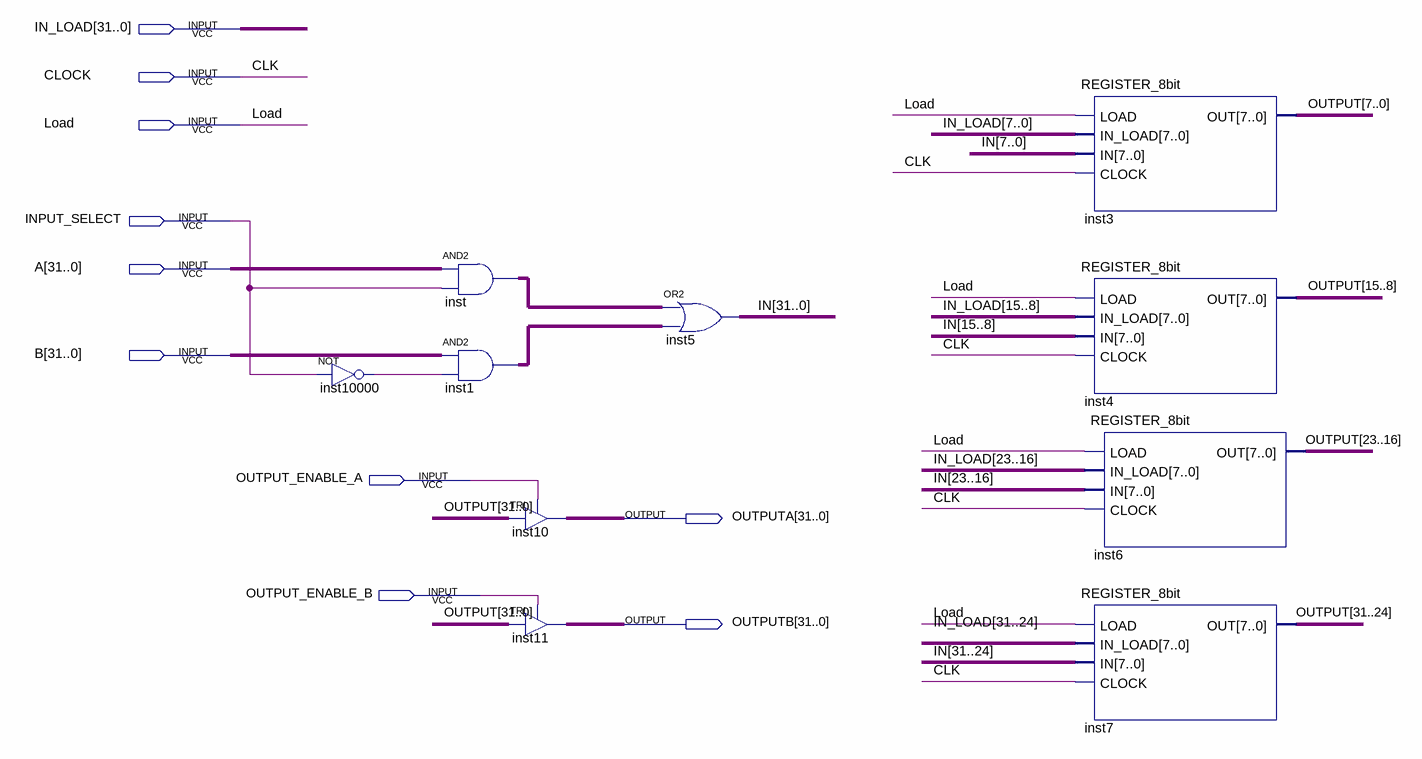
[diagram p0: schematic sheet]
// Quartus schematic REGISTER_32bits.bdf as structural Verilog: 10 symbols, 10 pins
module REGISTER_32bits (
  input  [31:0] IN_LOAD,
  input  CLOCK,
  input  Load,
  input  INPUT_SELECT,
  input  [31:0] A,
  input  [31:0] B,
  input  OUTPUT_ENABLE_A,
  input  OUTPUT_ENABLE_B,
  output [31:0] OUTPUTA,
  output [31:0] OUTPUTB
);

  wire inst10000_out;
  wire [31:0] IN, inst1_out, inst_out, OUTPUT;

  not inst10000 (inst10000_out, INPUT_SELECT);
  assign inst_out = A & {32{INPUT_SELECT}};  // AND2 inst, 32 bits wide
  assign inst1_out = B & {32{inst10000_out}};  // AND2 inst1, 32 bits wide
  TRI inst10[31:0] (.IN(OUTPUT), .OE(OUTPUT_ENABLE_A), .OUT(OUTPUTA));
  TRI inst11[31:0] (.IN(OUTPUT), .OE(OUTPUT_ENABLE_B), .OUT(OUTPUTB));
  assign IN = inst_out | inst1_out;  // OR2 inst5, 32 bits wide
  REGISTER_8bit inst3 (.LOAD(Load), .IN_LOAD(IN_LOAD[7:0]), .IN(IN[7:0]), .CLOCK(CLOCK), .OUT(OUTPUT[7:0]));
  REGISTER_8bit inst4 (.LOAD(Load), .IN_LOAD(IN_LOAD[15:8]), .IN(IN[15:8]), .CLOCK(CLOCK), .OUT(OUTPUT[15:8]));
  REGISTER_8bit inst6 (.LOAD(Load), .IN_LOAD(IN_LOAD[23:16]), .IN(IN[23:16]), .CLOCK(CLOCK), .OUT(OUTPUT[23:16]));
  REGISTER_8bit inst7 (.LOAD(Load), .IN_LOAD(IN_LOAD[31:24]), .IN(IN[31:24]), .CLOCK(CLOCK), .OUT(OUTPUT[31:24]));

  // Other names for the same wires on the sheet: CLK = CLOCK
endmodule
